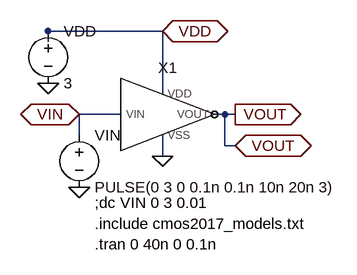
[diagram p0: schematic Inverter_Testbench.asc]
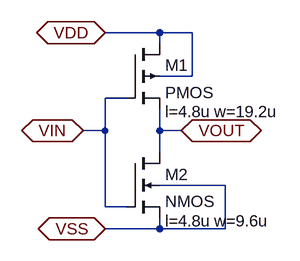
[diagram p1: sub-circuit invertor_jan20.asc]
Inverter_Testbench.asc, the LTspice schematic file:
Version 4
SHEET 1 880 680
WIRE 176 32 0 32
WIRE 0 48 0 32
WIRE 176 128 176 32
WIRE 112 160 48 160
WIRE 272 160 256 160
WIRE 288 160 272 160
WIRE 48 192 48 160
WIRE 272 208 272 160
WIRE 288 208 272 208
WIRE 176 224 176 192
FLAG 176 224 0
FLAG 288 160 VOUT
IOPIN 288 160 Out
FLAG 0 112 0
FLAG 48 272 0
FLAG 176 32 VDD
IOPIN 176 32 BiDir
FLAG 48 160 VIN
IOPIN 48 160 BiDir
FLAG 288 208 VOUT
IOPIN 288 208 BiDir
SYMBOL Invertor_Jan20 176 160 R0
SYMATTR InstName X1
SYMBOL voltage 48 176 R0
WINDOW 123 0 0 Left 2
WINDOW 39 0 0 Left 2
SYMATTR InstName VIN
SYMATTR Value PULSE(0 3 0 0.1n 0.1n 10n 20n 3)
SYMBOL voltage 0 16 R0
WINDOW 123 0 0 Left 2
WINDOW 39 0 0 Left 2
SYMATTR InstName VDD
SYMATTR Value 3
TEXT 72 296 Left 2 !;dc VIN 0 3 0.01
TEXT 72 328 Left 2 !.include cmos2017_models.txt
TEXT 72 360 Left 2 !.tran 0 40n 0 0.1n

invertor_jan20.asc, the sub-circuit schematic file:
Version 4
SHEET 1 880 680
WIRE 192 0 112 0
WIRE 240 0 192 0
WIRE 192 16 192 0
WIRE 240 64 240 0
WIRE 240 64 192 64
WIRE 144 96 112 96
WIRE 112 144 112 96
WIRE 112 144 80 144
WIRE 192 144 192 112
WIRE 224 144 192 144
WIRE 192 176 192 144
WIRE 288 224 192 224
WIRE 112 256 112 144
WIRE 144 256 112 256
WIRE 192 288 192 272
WIRE 192 288 112 288
WIRE 288 288 288 224
WIRE 288 288 192 288
FLAG 80 144 VIN
IOPIN 80 144 BiDir
FLAG 224 144 VOUT
IOPIN 224 144 BiDir
FLAG 112 0 VDD
IOPIN 112 0 BiDir
FLAG 112 288 VSS
IOPIN 112 288 BiDir
SYMBOL pmos4 144 16 R0
WINDOW 123 56 100 Left 2
SYMATTR Value2 l=4.8u w=19.2u
SYMATTR InstName M1
SYMBOL nmos4 144 176 R0
WINDOW 123 56 100 Left 2
SYMATTR Value2 l=4.8u w=9.6u
SYMATTR InstName M2

The netlist it stands for:
* Inverter_Testbench.asc
XX1 VDD VIN 0 VOUT invertor_jan20
VIN VIN 0 PULSE(0 3 0 0.1n 0.1n 10n 20n 3)
VDD VDD 0 3

* block symbol definitions
.subckt invertor_jan20 VDD VIN VSS VOUT
M1 VDD VIN VOUT VDD PMOS l=4.8u w=19.2u
M2 VOUT VIN VSS VSS NMOS l=4.8u w=9.6u
.ends invertor_jan20

.model NMOS NMOS
.model PMOS PMOS
.lib standard.mos
;dc VIN 0 3 0.01
.include cmos2017_models.txt
.tran 0 40n 0 0.1n
.backanno
.end

* Results of the author's LTspice run, read from the files saved beside the schematic
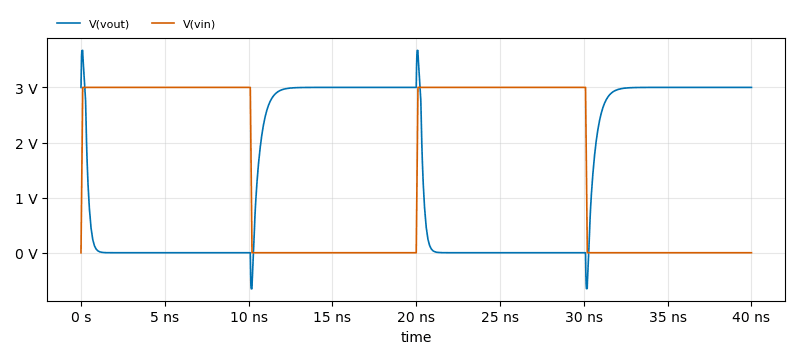
[diagram p2: Transient Analysis of Inverter_Testbench.asc, plotted from the saved traces]
* Transient Analysis, 1 run:
*   V(vout): min -654.5 mV, max 3.672 V, average 1.463 V, rms 2.071 V, last 3 V
*   V(vin): min 0 V, max 3 V, average 1.515 V, rms 2.128 V, last 0 V